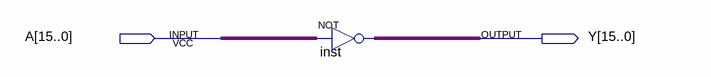
[diagram p0: schematic sheet]
// Quartus schematic NOT_16Bit.bdf as structural Verilog: 1 symbols, 2 pins
module NOT_16Bit (
  input  [15:0] A,
  output [15:0] Y
);

  assign Y = ~A;  // NOT inst, 16 bits wide
endmodule
